# EAGLE design USB-RS485_ConversionAdapter (EAGLE 9.6.2)
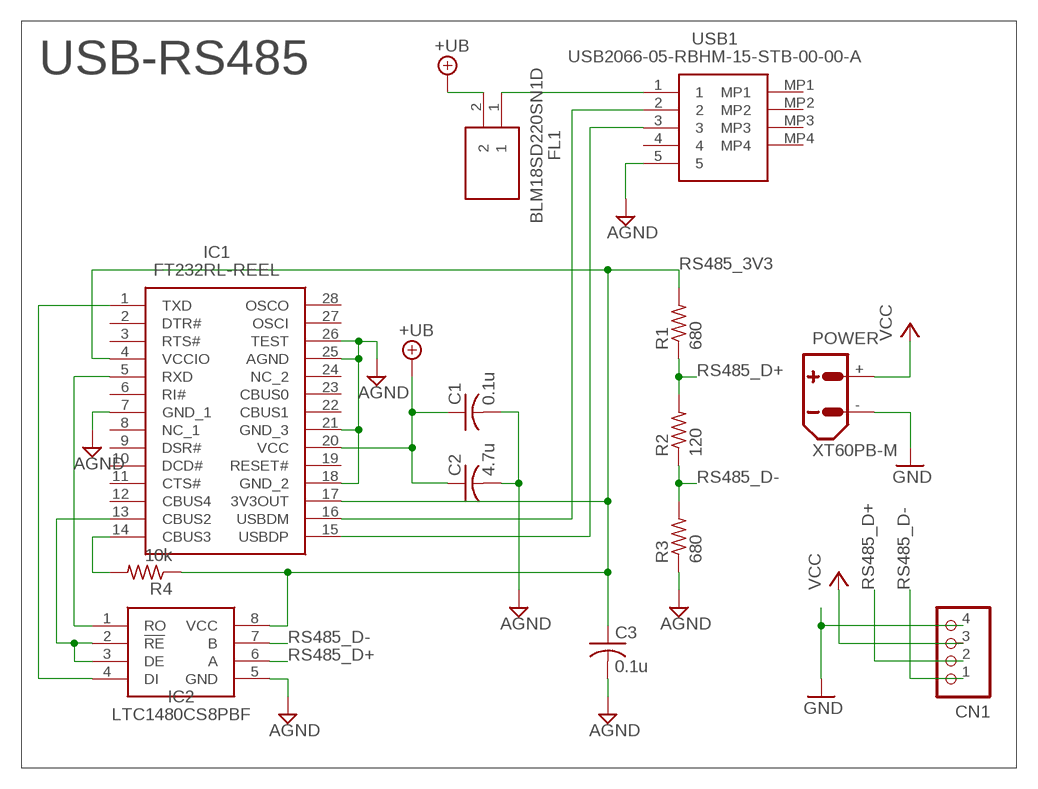
[diagram p0: schematic, sheet 1]

## Parts
C1  0.1u  C-USC1608  [C1608]
C2  4.7u  C-USC1608  [C1608]
C3  0.1u  C-USC1608  [C1608]
CN1  B4B-XH-A  [B4B-XH-A]
FL1  BLM18SD220SN1D  [BLM18AG102BH1D]
IC1  FT232RL-REEL  [SOP65P778X200-28N]
IC2  LTC1480CS8PBF  [SOIC127P599X175-8N]
POWER  XT60PB-M  [XT60PB-M]
R1  680  R-US_R0603  [R0603]
R2  120  R-US_R0603  [R0603]
R3  680  R-US_R0603  [R0603]
R4  10k  R-US_R0603  [R0603]
USB1  USB2066-05-RBHM-15-STB-00-00-A  [USB206605RBHM15STB0000A]

## Nets
+UB [USB_POWER]: C1.1 C2.1 FL1.2 IC1.20(VCC)
AGND [USB_POWER]: C1.2 C2.2 C3.2 IC1.7(GND_1) IC1.18(GND_2) IC1.21(GND_3) IC1.25(AGND) IC1.26(TEST) IC2.5(GND) R3.1 USB1.5
GND [GND]: CN1.4 POWER.-
RS485_1 [USB_SIGNAL]: IC1.14(CBUS3) R4.2
RS485_2 [USB_SIGNAL]: IC1.13(CBUS2) IC2.2(!RE) IC2.3(DE)
RS485_3V3 [USB_POWER]: C3.1 IC1.4(VCCIO) IC1.17(3V3OUT) IC2.8(VCC) R1.2 R4.1
RS485_D+ [USB_SIGNAL]: CN1.2 IC2.6(A) R1.1 R2.2
RS485_D- [USB_SIGNAL]: CN1.1 IC2.7(B) R2.1 R3.2
RXD [USB_SIGNAL]: IC1.5(RXD) IC2.1(RO)
TXD [USB_SIGNAL]: IC1.1(TXD) IC2.4(DI)
USB_5V [USB_POWER]: FL1.1 USB1.1
USB_D+ [USB_SIGNAL]: IC1.15(USBDP) USB1.3
USB_D- [USB_SIGNAL]: IC1.16(USBDM) USB1.2
VCC [VCC]: CN1.3 POWER.+
Unconnected: IC1.2(DTR#) IC1.3(RTS#) IC1.6(RI#) IC1.8(NC_1) IC1.9(DSR#) IC1.10(DCD#) IC1.11(CTS#) IC1.12(CBUS4) IC1.19(RESET#) IC1.22(CBUS1) IC1.23(CBUS0) IC1.24(NC_2) IC1.27(OSCI) IC1.28(OSCO) USB1.4 USB1.MP1 USB1.MP2 USB1.MP3 USB1.MP4

## Notes on the sheet
- USB-RS485

## Library data of the parts
C1-C3 = rcl:C-US: CAPACITOR, American symbol; SPICEPREFIX: C
CN1 = jst-xh:B4B-XH-A: Wire-to-Board 2.5mm pitch top mount connector Source: http://www.jst-mfg.com/product/pdf/jpn/XH.pdf http://www.jst-mfg.com/product/detail.php?series=277
FL1 = SamacSys_Parts:BLM18SD220SN1D: BLM18_N1D Series EMI Suppression Filter 22+/-25% at 100MHz 6A @85 Source: Datasheet <https://componentsearchengine.com/Datasheets/1/BLM18SD220SN1D.pdf>; DESCRIPTION: BLM18_N1D Series EMI Suppression Filter 22+/-25% at 100MHz 6A @85; HEIGHT: 0.95mm; MANUFACTURER_NAME: Murata Electronics; MANUFACTURER_PART_NUMBER: BLM18SD220SN1D; MOUSER_PART_NUMBER: 81-BLM18SD220SN1D; MOUSER_PRICE-STOCK: https://www.mouser.com/Search/Refine.aspx?Keyword=81-BLM18SD220SN1D
IC1 = SamacSys_Parts:FT232RL-REEL: USB/Serial IC UART SSOP-28 FTDI Chip FT232RL-REEL, USB Controller, 3MBd, USB 2.0, 1.8 5.25 V, 28-Pin SSOP Source: Datasheet <http://www.ftdichip.com/Support/Documents/DataSheets/ICs/DS_FT232R.pdf>; DESCRIPTION: USB/Serial IC UART SSOP-28 FTDI Chip FT232RL-REEL, USB Controller, 3MBd, USB 2.0, 1.8 5.25 V, 28-Pin SSOP; HEIGHT: 2mm; MANUFACTURER_NAME: FTDI Chip; MANUFACTURER_PART_NUMBER: FT232RL-REEL; MOUSER_PART_NUMBER: 895-FT232RL; MOUSER_PRICE-STOCK: https://www.mouser.co.uk/ProductDetail/FTDI/FT232RL-REEL?qs=D1%2FPMqvA103RC6OU6bKtoA%3D%3D
IC2 = SamacSys_Parts:LTC1480CS8PBF: 3.3V Ultralow Power RS485 Transceiver Source: Datasheet <https://www.analog.com/media/en/technical-documentation/data-sheets/1480fa.pdf>; DESCRIPTION: 3.3V Ultralow Power RS485 Transceiver; HEIGHT: 1.752mm; MANUFACTURER_NAME: Linear Technology; MANUFACTURER_PART_NUMBER: LTC1480CS8PBF
POWER = amass:XT60: AMASS XT60 connector Store in Japan AMASS XT60 connector <https://szc.jp/ams-xt60>
R1-R4 = rcl:R-US_: RESISTOR, American symbol; SPICEPREFIX: R
USB1 = SamacSys_Parts:USB2066-05-RBHM-15-STB-00-00-A: GCT (GLOBAL CONNECTOR TECHNOLOGY) - USB2066-05-RBHM-15-STB-00-00-A - USB Connector, Mini USB Type B, USB 2.0, Receptacle, 5 Positions, Surface Mount, Right Angle Source: Datasheet; DESCRIPTION: GCT (GLOBAL CONNECTOR TECHNOLOGY) - USB2066-05-RBHM-15-STB-00-00-A - USB Connector, Mini USB Type B, USB 2.0, Receptacle, 5 Positions, Surface Mount, Right Angle; HEIGHT: 4.25mm; MANUFACTURER_NAME: GCT (GLOBAL CONNECTOR TECHNOLOGY); MANUFACTURER_PART_NUMBER: USB2066-05-RBHM-15-STB-00-00-A; MOUSER_PART_NUMBER: 640-2665RBHM15STB00A; MOUSER_PRICE-STOCK: https://www.mouser.co.uk/ProductDetail/GCT/USB2066-05-RBHM-15-STB-00-00-A?qs=KUoIvG%2F9IlZEo87a0wQR%252BA%3D%3D

## Net classes
0 default: width 0.254 mm, drill 0.127 mm, clearance 0.203 mm
1 VCC: width 1.778 mm, drill 0.889 mm, clearance 0.203 mm
2 USB_POWER: width 0.254 mm, drill 0.127 mm, clearance 0.203 mm
4 GND: width 1.27 mm, drill 0.635 mm, clearance 0.203 mm
5 USB_SIGNAL: width 0.254 mm, drill 0.127 mm, clearance 0.203 mm

## Board
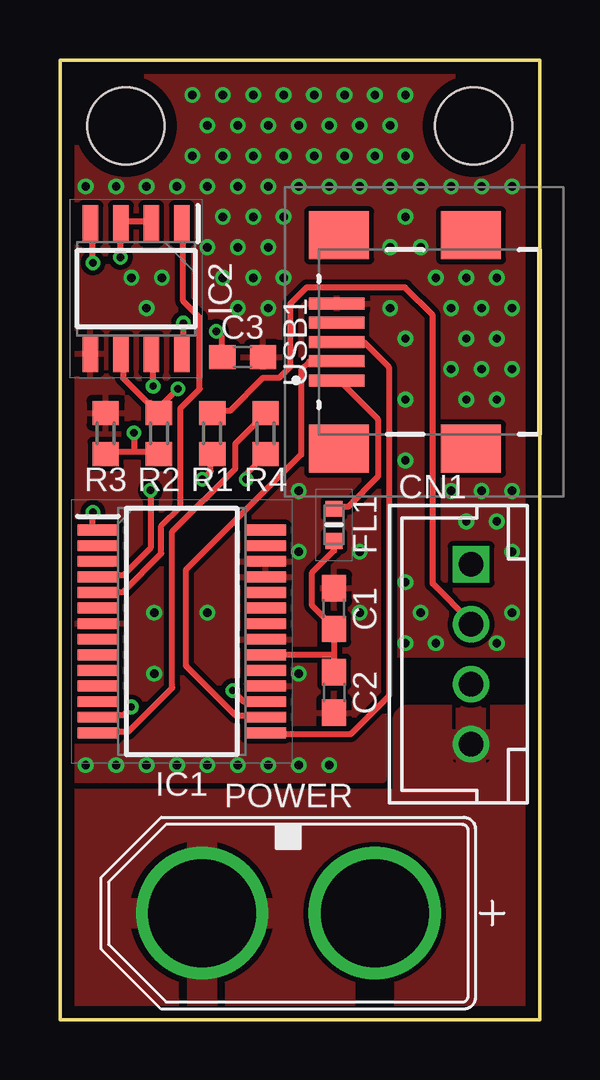
[diagram p1: board, top side]
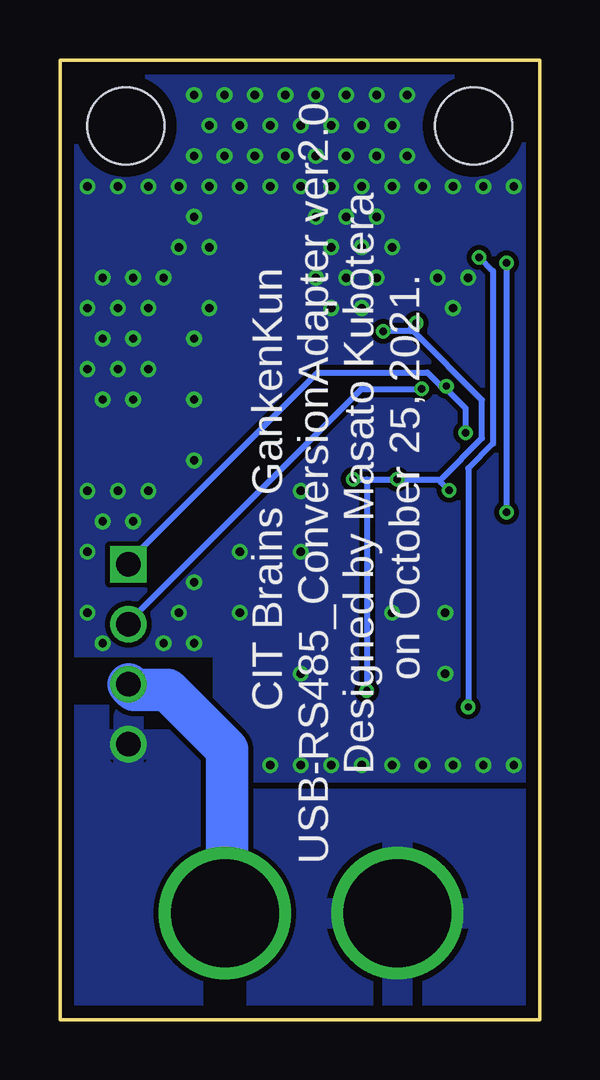
[diagram p2: board, bottom side, seen from below]

Size 20 x 40 mm. Coordinates in mm from the lower left corner, seen from the top.
Outline: 0,40 0,0 20,0 20,40 0,40
Copper layers (1*16): Top 0.035mm / dielectric 1.6mm / Bottom 0.035mm
Design rules "Elecrow_2-layer_PCB_eagle_rule *": minimum track width 6mil, minimum drill 12mil, track to track 6mil, track to pad 6mil, pad to pad 6mil, via to via 8mil, smd to smd 0mil, copper to edge 20mil, drill to drill 10mil, minimum pad ring 6mil, minimum via ring 6mil, stop-mask expansion 0mil, vias tented up to drill 100mil, thermal gap 10mil
Holes 3.2 mm at 17.25,37.25 2.75,37.25

### Footprints (pad centres in the part's own frame; a part is rotated, then mirrored left to right if it is on the bottom)
C1608 = smd 1.1 x 1: 1 -0.85,0; 2 0.85,0
B4B-XH-A = drill 1.016 square: 1 -3.75,0 | drill 1.016: 2 -1.25,0; 3 1.25,0; 4 3.75,0
BLM18AG102BH1D = smd 0.65 x 0.7: 1 -0.675,0; 2 0.675,0
SOP65P778X200-28N = smd 1.7 x 0.45: 1 -3.5,4.225; 2 -3.5,3.575; 3 -3.5,2.925; 4 -3.5,2.275; 5 -3.5,1.625; 6 -3.5,0.975; 7 -3.5,0.325; 8 -3.5,-0.325; 9 -3.5,-0.975; 10 -3.5,-1.625; 11 -3.5,-2.275; 12 -3.5,-2.925; 13 -3.5,-3.575; 14 -3.5,-4.225; 15 3.5,-4.225; 16 3.5,-3.575; 17 3.5,-2.925; 18 3.5,-2.275; 19 3.5,-1.625; 20 3.5,-0.975; 21 3.5,-0.325; 22 3.5,0.325; 23 3.5,0.975; 24 3.5,1.625; 25 3.5,2.275; 26 3.5,2.925; 27 3.5,3.575; 28 3.5,4.225
SOIC127P599X175-8N = smd 1.526 x 0.65: 1 -2.712,1.905; 2 -2.712,0.635; 3 -2.712,-0.635; 4 -2.712,-1.905; 5 2.712,-1.905; 6 2.712,-0.635; 7 2.712,0.635; 8 2.712,1.905
XT60PB-M = drill 4.5: + 3.6,0; - -3.6,0
R0603 = smd 1 x 1.1: 1 -0.85,0; 2 0.85,0
USB206605RBHM15STB0000A = smd 0.5 x 2.3: 1 -1.6,5.6; 2 -0.8,5.6; 3 0,5.6; 4 0.8,5.6; 5 1.6,5.6 | smd 2 x 2.5: MP1 -4.45,5.5; MP2 4.45,5.5; MP3 4.45,0; MP4 -4.45,0

### Placement (x,y rotation side)
C1  11.43,17.13 90 top
C2  11.43,13.64 270 top
C3  7.62,27.61 0 top
CN1  17.14,15.22 270 top
FL1  11.43,20.62 270 top
IC1  5.08,16.18 0 top
IC2  3.17,30.46 270 top
POWER  9.53,4.43 0 top
R1  6.35,24.43 270 top
R2  4.13,24.43 90 top
R3  1.91,24.43 270 top
R4  8.57,24.43 90 top
USB1  17.14,28.24 90 top

### Tracks (layer width: path | path; a pad name or v marks a point on that pad's centre or on a via)
+UB
  Top 0.254: FL1.2 11.43,19.55 10.52,18.63 10.52,17.26 11.43,16.34 C1.1 11.43,15.2 | 11.43,15.2 C2.1 | 11.43,15.2 8.69,15.2 IC1.20
AGND  (via drill 0.35)
  other vias: 1.07,34.73 2.98,30.92 2.34,34.73 3.93,14.41 3.93,16.95 3.61,29.65 4.25,30.92 3.61,34.73 4.88,34.73 5.52,36 5.52,38.54 6.15,16.95 6.79,30.92 6.15,32.19 6.79,33.46 6.15,34.73 6.79,36 6.15,37.27 6.79,38.54 7.42,29.65 8.06,30.92 7.42,32.19 8.06,33.46 7.42,34.73 8.06,36 7.42,37.27 8.06,38.54 8.69,29.65 9.33,30.92 8.69,32.19 9.33,33.46 8.69,34.73 9.33,36 8.69,37.27 9.33,38.54 9.96,14.41 9.96,19.49 9.96,22.03 9.96,34.73 10.6,36 9.96,37.27 10.6,38.54 11.23,34.73 11.87,36 11.23,37.27 11.87,38.54 12.5,16.95 12.5,19.49 12.5,34.73 13.14,36 12.5,37.27 13.14,38.54 14.41,15.68 14.41,18.22 14.41,23.3 14.41,25.84 14.41,28.38 13.77,29.65 13.77,32.19 14.41,33.46 13.77,34.73 14.41,36 13.77,37.27 14.41,38.54 15.68,15.68 15.04,16.95 15.68,30.92 15.04,32.19 15.04,34.73 16.95,20.76 16.31,22.03 16.95,25.84 16.31,27.11 16.95,28.38 16.31,29.65 16.95,30.92 16.31,34.73 18.22,15.68 18.22,20.76 17.58,22.03 18.22,25.84 17.58,27.11 18.22,28.38 17.58,29.65 18.22,30.92 17.58,34.73 18.85,16.95 18.85,19.49 18.85,22.03 18.85,27.11 18.85,29.65 18.85,34.73 1.07,10.6 2.34,10.6 3.61,10.6 4.88,10.6 6.15,10.6 7.42,10.6 8.69,10.6 9.96,10.6 11.23,10.6
  pour Top: 0,40 0,10 13.5,10 13.5,15.22 20,15.22 20,40
  pour Bottom: 0,40 0,10 13.5,10 13.5,15.22 20,15.22 20,40
GND
  pour Bottom: 0,9 0,0 20,0 20,12.5 14.5,12.5 14.5,9
  pour Top: 0,9 0,0 20,0 20,12.5 14.5,12.5 14.5,9
RS485_1
  Top 0.254: R4.2 8.57,25.26 7.32,24 7.32,22.97 4.69,20.34 4.69,13.83 2.86,12 1.6,12 IC1.14
RS485_2  (via drill 0.3)
  Top 0.254: IC2.2 3.77,33.26 2.63,33.26 IC2.3 2.52,33.15 v2.52,31.77 | v2.97,13.03 2.63,12.69 1.6,12.69 IC1.13
  Bottom 0.254: v2.97,13.03 2.97,22.97 1.94,24 1.94,31.2 v2.52,31.77
RS485_3V3  (via drill 0.3)
  Top 0.254: v5.94,22.52 6.29,22.86 6.29,23.55 R1.2 | v7.77,22.52 7.77,22.75 8.57,23.55 R4.1 | v6.51,28.69 6.74,28.46 6.74,27.66 C3.1 | v5.14,29.03 5.14,27.77 IC2.8 | v3.77,22.06 3.77,19.66 2.63,18.52 1.6,18.52 IC1.4 | v7.2,13.72 7.66,13.26 IC1.17
  Bottom 0.254: v7.77,22.52 7.2,22.52 | 7.2,22.52 v5.94,22.52 4.12,22.52 | 5.37,28.69 5.26,28.69 2.4,25.83 2.4,24.23 4.12,22.52 | 5.37,28.69 v6.51,28.69 | v5.14,29.03 5.37,28.8 5.37,28.69 | v3.77,22.06 4.12,22.4 4.12,22.52 | 7.2,22.52 v7.2,13.72
RS485_D+  (via drill 0.3)
  Top 0.254: IC2.6 2.63,27.66 2.63,26.75 3.66,25.72 3.77,25.72 4.12,25.38 R2.2 4.12,25.49 v4.92,26.29 | R1.1 6.4,25.38 7.09,25.38 8.46,26.75 9.14,26.75 9.6,27.2 9.6,29.83 10.29,30.52 14.39,30.52 15.54,29.36 15.54,18.17 17.14,16.57 CN1.2
  Bottom 0.254: v4.92,26.29 7.43,26.29 17.14,16.57 CN1.2
RS485_D-  (via drill 0.3)
  Top 0.254: 3.09,23.66 4.12,23.66 R2.1 | 3.09,23.66 1.94,23.66 R3.2 | v3.89,26.4 3.89,27.66 IC2.7 | v3.09,24.46 3.09,23.66
  Bottom 0.254: CN1.1 17.14,19.09 9.26,26.98 4.69,26.98 4.12,26.4 v3.89,26.4 3.89,26.29 3.09,25.49 v3.09,24.46
RXD
  Top 0.254: IC2.1 5.14,33.15 5.14,29.95 5.83,29.26 5.83,26.29 5.03,25.49 5.03,21.37 4.23,20.57 4.23,19.43 2.63,17.83 1.6,17.83 IC1.5
TXD  (via drill 0.3)
  Top 0.254: v1.37,31.55 1.37,33.15 IC2.4 | v1.37,21.14 1.37,20.57 1.49,20.46 IC1.1
  Bottom 0.254: v1.37,21.14 v1.37,31.55
USB_5V
  Top 0.254: FL1.1 11.43,21.37 12,21.37 13.26,22.63 13.26,25.03 11.66,26.63 USB1.1
USB_D+
  Top 0.254: IC1.15 8.69,11.89 12.12,11.89 13.72,13.49 13.72,27.2 12.69,28.23 11.66,28.23 USB1.3
USB_D-
  Top 0.254: IC1.16 8.57,12.69 7.32,12.69 5.25,14.76 5.25,18.73 10.06,23.55 10.06,27.09 10.4,27.43 USB1.2
VCC
  Bottom 1.778: CN1.3 16.91,13.74 15.51,13.74 13.03,11.27 13.03,4.43 POWER.+

### Text on the board
bPlace: CIT Brains GankenKun / USB-RS485_ConversionAdapter ver2.0 / Designed by Masato Kubotera / on October 25, 2021.